# EAGLE design Triangulator-LM358 (EAGLE 7.6.0)
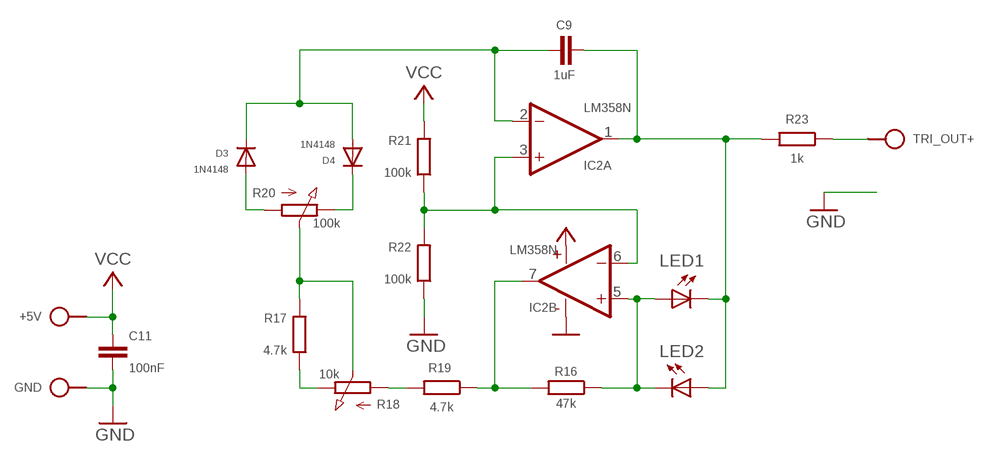
[diagram p0: schematic, sheet 1]

## Parts
+5V  VCC  SPAD  [SPAD]
C9  1uF  C050-020X036/V  [C050-020X036/V]
C11  100nF  C050-020X036  [C050-020X036]
D3  1N4148  1N414834-5V  [DO34-5V]
D4  1N4148  1N414834-5V  [DO34-5V]
GND  GND  SPAD  [SPAD]
IC2  LM358N  [DIL08]
LED1  LED3MM  [LED3MM]
LED2  LED3MM  [LED3MM]
R16  47k  R0202/7-V  [0202/7-V]
R17  4.7k  R0202/7  [0202/7]
R18  10k  POT  [POT]
R19  4.7k  R0202/7-V  [0202/7-V]
R20  100k  POT  [POT]
R21  100k  R0202/7-V  [0202/7-V]
R22  100k  R0202/7-V  [0202/7-V]
R23  1k  R0202/5  [0202/5]
TRI_OUT+  TRIANGLE  SPAD  [SPAD]

## Nets
GND: C11.2 GND.1 IC2.4(P:V-) R22.1
N$14: IC2.7(B:OUT) R16.2 R19.1
N$15: IC2.5(B:+IN) LED1.A LED2.K(C) R16.1
N$22: D3.A R20.1(A)
N$23: D4.C R20.3(E)
N$24: R17.2 R18.2(S) R20.2(S)
N$25: R17.1 R18.3(E)
N$26: C9.1 D3.C D4.A IC2.2(A:-IN)
N$27: R18.1(A) R19.2
N$28: C9.2 IC2.1(A:OUT) LED1.K(C) LED2.A R23.2
N$29: R23.1 TRI_OUT+.1
N$30: IC2.3(A:+IN) IC2.6(B:-IN) R21.1 R22.2
VCC: +5V.1 C11.1 IC2.8(P:V+) R21.2

## Library data of the parts
+5V GND TRI_OUT+ = pad:SPAD
C9 C11 = c:C: CAPACITOR, European symbol
D3 D4 = d:1N4148
IC2 = ic:LM358: OP AMP also LM158; LM258; LM2904 Source: http://cache.national.com/ds/LM/LM158.pdf
LED1 LED2 = led:LED: LED OSRAM: - CHIPLED LG R971, LG N971, LY N971, LG Q971, LY Q971, LO R971, LY R971 LH N974, LH R974 LS Q976, LO Q976, LY Q976 LO Q996 - Hyper CHIPLED LW Q18S LB Q993, LB Q99A, LB R99A - SideLED LS A670, LO A670, LY A670, LG A670, LP A670 LB A673, LV A673, LT A673, LW A673 LH A674 LY A675 LS A676, LA A676, LO A676, LY A676, LW A676 LS A679, LY A679, LG A679 - Hyper Micro SIDELED® LS Y876, LA Y876, LO Y876, LY Y876 LT Y87S - SmartLED LW L88C, LW L88S LB L89C, LB L89S, LG L890 LS L89K, LO L89K, LY L89K LS L896, LA L896, LO L896, LY L896 - TOPLED LS T670, LO T670, LY T670, LG T670, LP T670 LSG T670, LSP T670, LSY T670, LOP T670, LYG T670 LG T671, LOG T671, LSG T671 LB T673, LV T673, LT T673, LW T673 LH T674 LS T676, LA T676, LO T676, LY T676, LB T676, LH T676, LSB T676, LW T676 LB T67C, LV T67C, LT T67C, LS T67K, LO T67K, LY T67K, LW E67C LS E67B, LA E67B, LO E67B, LY E67B, LB E67C, LV E67C, LT E67C LW T67C LS T679, LY T679, LG T679 LS T770, LO T770, LY T770, LG T770, LP T770 LB T773, LV T773, LT T773, LW T773 LH T774 LS E675, LA E675, LY E675, LS T675 LS T776, LA T776, LO T776, LY T776, LB T776 LHGB T686 LT T68C, LB T68C - Hyper Mini TOPLED® LB M676 - Mini TOPLED Santana® LG M470 LS M47K, LO M47K, LY M47K Source: http://www.osram.convergy.de LUXEON: - LUMILED® LXK2-PW12-R00, LXK2-PW12-S00, LXK2-PW14-U00, LXK2-PW14-V00 LXK2-PM12-R00, LXK2-PM12-S00, LXK2-PM14-U00 LXK2-PE12-Q00, LXK2-PE12-R00, LXK2-PE12-S00, LXK2-PE14-T00, LXK2-PE14-U00 LXK2-PB12-K00, LXK2-PB12-L00, LXK2-PB12-M00, LXK2-PB14-N00, LXK2-PB14-P00, LXK2-PB14-Q00 LXK2-PR12-L00, LXK2-PR12-M00, LXK2-PR14-Q00, LXK2-PR14-R00 LXK2-PD12-Q00, LXK2-PD12-R00, LXK2-PD12-S00 LXK2-PH12-R00, LXK2-PH12-S00 LXK2-PL12-P00, LXK2-PL12-Q00, LXK2-PL12-R00 Source: www.luxeon.com KINGBRIGHT: KA-3528ASYC Source: www.kingbright.com
R16 R17 R19 R21-R23 = r:R: RESISTOR, European symbol
R18 R20 = r:POT

## Board
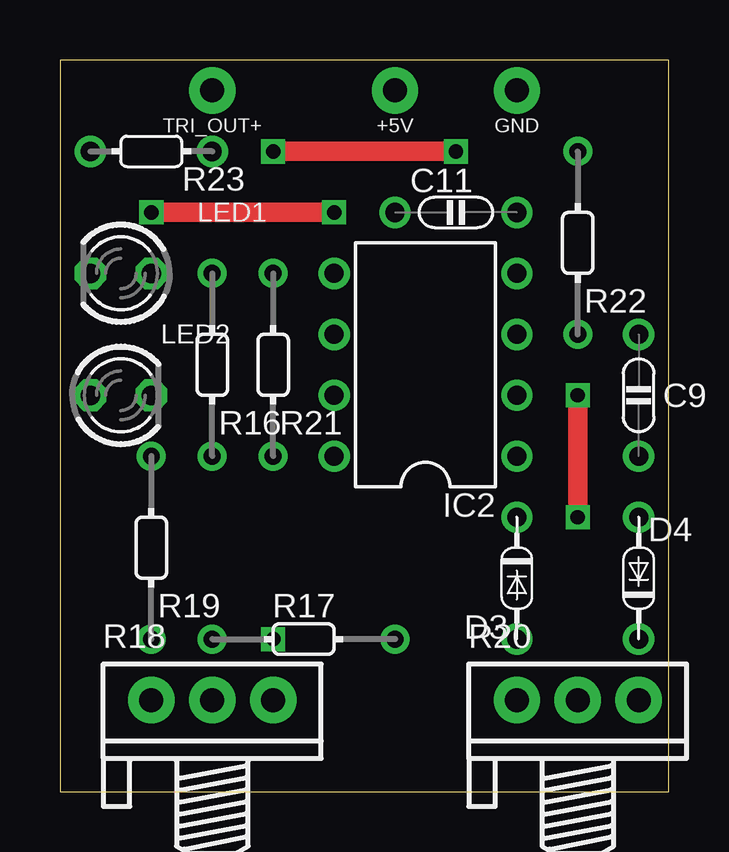
[diagram p1: board, top side]
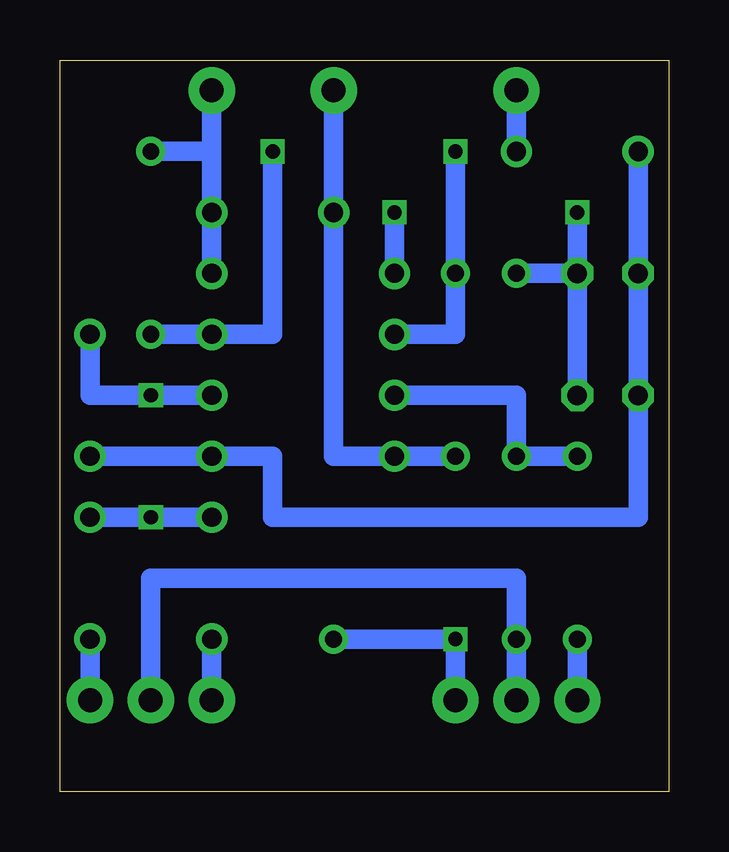
[diagram p2: board, bottom side, seen from below]

Size 25.38 x 30.48 mm. Coordinates in mm from the lower left corner, seen from the top.
Outline: 0,0 25.38,0 25.38,30.48 0,30.48 0,0
Copper layers (1*16): Top 0.035mm / dielectric 1.5mm / Bottom 0.035mm
Design rules "default": minimum track width 10mil, minimum drill 24mil, track to track 8mil, track to pad 8mil, pad to pad 8mil, via to via 8mil, smd to smd 8mil, copper to edge 40mil, drill to drill 8mil, minimum pad ring 10mil, minimum via ring 8mil, stop-mask expansion 4mil, vias tented up to drill 0mil, thermal gap 10mil

### Footprints (pad centres in the part's own frame; a part is rotated, then mirrored left to right if it is on the bottom)
SPAD = drill 1 pad 1.93: 1 0,0
C050-020X036/V = drill 0.8: 1 0,-2.54; 2 0,2.54
C050-020X036 = drill 0.8: 1 -2.54,0; 2 2.54,0
DO34-5V = drill 0.8: A 0,2.54; C 0,-2.54
DIL08 = drill 0.8 pad 1.27: 1 -3.81,-3.81; 2 -1.27,-3.81; 3 1.27,-3.81; 4 3.81,-3.81; 5 3.81,3.81; 6 1.27,3.81; 7 -1.27,3.81; 8 -3.81,3.81
LED3MM = drill 0.813 octagon: A -1.27,0; K 1.27,0
0202/7-V = drill 0.7: 1 0,-3.81; 2 0,3.81
0202/7 = drill 0.7: 1 0,3.81; 2 0,-3.81
POT = drill 1 pad 1.93: 1 -2.54,0; 2 0,0; 3 2.54,0
0202/5 = drill 0.8: 1 -2.54,0; 2 2.54,0

### Placement (x,y rotation side)
+5V  13.97,29.21 90 top
C9  24.13,16.51 180 top
C11  16.51,24.13 0 top
D3  19.05,8.89 180 top
D4  24.13,8.89 0 top
GND  19.05,29.21 90 top
IC2  15.24,17.78 90 top
LED1  2.54,21.59 180 top
LED2  2.54,16.51 0 top
R16  6.35,17.78 180 top
R17  10.16,6.35 270 top
R18  6.35,3.81 0 top
R19  3.81,10.16 180 top
R20  21.59,3.81 0 top
R21  8.89,17.78 180 top
R22  21.59,22.86 180 top
R23  3.81,26.67 180 top
TRI_OUT+  6.35,29.21 90 top

### Tracks (layer width: path | path; a pad name or v marks a point on that pad's centre or on a via)
GND
  Bottom 0.813: R22.1 19.05,26.67 C11.2 | IC2.4 C11.2 | C11.2 GND.1
N$14
  Bottom 0.813: R19.1 R16.2 6.35,16.51 IC2.7
N$15  (via drill 0.6)
  Top 0.813: v11.43,24.13 v3.81,24.13
  Bottom 0.813: IC2.5 v11.43,24.13 | v3.81,24.13 LED1.A | R16.1 LED1.A | LED1.A LED2.K
N$22
  Bottom 0.813: D3.A R20.1
N$23
  Bottom 0.813: D4.C R20.3
N$24
  Bottom 0.813: R17.2 R18.2 6.35,8.89 21.59,8.89 R20.2
N$25  (via drill 0.6)
  Bottom 0.813: R17.1 v8.89,6.35 R18.3
N$26  (via drill 0.6)
  Top 0.813: v21.59,11.43 v21.59,16.51
  Bottom 0.813: D4.A v21.59,11.43 D3.C | IC2.2 v21.59,16.51 24.13,16.51 C9.1
N$27
  Bottom 0.813: R18.1 R19.2
N$28
  Bottom 0.813: C9.2 IC2.1 16.51,13.97 16.51,11.43 1.27,11.43 LED2.A LED1.K R23.2
N$29
  Bottom 0.813: R23.1 TRI_OUT+.1
N$30  (via drill 0.6)
  Top 0.813: v16.51,26.67 v8.89,26.67
  Bottom 0.813: R22.2 IC2.3 16.51,19.05 v16.51,26.67 | IC2.6 8.89,19.05 R21.1 v8.89,26.67
VCC
  Bottom 0.813: +5V.1 C11.1 13.97,13.97 IC2.8 R21.2